# Altium schematic sheet LEDArray.SchDoc
size A4
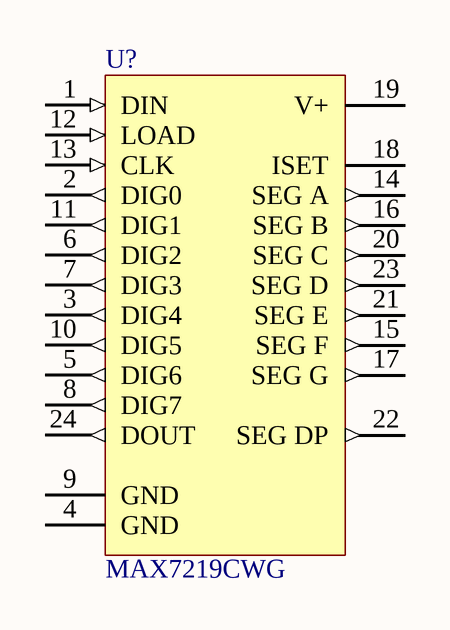
[diagram p0: LEDArray.SchDoc]

## Parts
U?  MAX7219CWG  [WSO24_N]

## Nets

Not connected (* = marked no-connect by the designer): U? 1(DIN) 2(DIG0) 3(DIG4) 4(GND) 5(DIG6) 6(DIG2) 7(DIG3) 8(DIG7) 9(GND) 10(DIG5) 11(DIG1) 12(LOAD) 13(CLK) 14(SEG_A) 15(SEG_F) 16(SEG_B) 17(SEG_G) 18(ISET) 19(V+) 20(SEG_C) 21(SEG_E) 22(SEG_DP) 23(SEG_D) 24(DOUT)

## Notes on the sheet
- Title
- Size:
- Date:
- A4
- Number:
- Time:
- Revision:
- Sheet
- of
- File:

## Library data of the parts
U? = MAX7219CWG: Serially Interfaced, 8-Digit LED Display Driver; Published: 16-Jan-2001; LatestRevisionDate: 13-Apr-2006; LatestRevisionNote: IPC-7351 Footprint Added.; DatasheetVersion: Jul-1997; PackageReference: WSO24; Publisher: Altium Limited; PackageDescription: 24-Pin Small Outline Integrated Circuit 1.27 mm Pitch; ComponentLink1Description: Manufacturer Link; ComponentLink1URL: http://www.maxim-ic.com/; ComponentLink2Description: Datasheet; ComponentLink2URL: http://pdfserv.maxim-ic.com/en/ds/MAX7219-MAX7221.pdf